# Altium schematic sheet Debug_SDIO.SchDoc: Debug SDIO
size A4
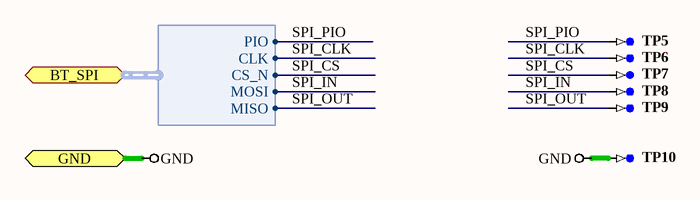
[diagram p0: Debug_SDIO.SchDoc]

## Parts
TP5  TP-SM-C-100  [TP-SM-C-100]  (value not drawn)  (no BOM)
TP6  TP-SM-C-100  [TP-SM-C-100]  (value not drawn)  (no BOM)
TP7  TP-SM-C-100  [TP-SM-C-100]  (value not drawn)  (no BOM)
TP8  TP-SM-C-100  [TP-SM-C-100]  (value not drawn)  (no BOM)
TP9  TP-SM-C-100  [TP-SM-C-100]  (value not drawn)  (no BOM)
TP10  TP-SM-C-100  [TP-SM-C-100]  (value not drawn)  (no BOM)

## Ports
BT_SPI (harness SPI_CSR1010), GND

## Harnesses
SPI_CSR1010: MISO, CS_N, PIO, MOSI, CLK

## Nets
GND: TP10.1 ; port GND
SPI_CLK: TP6.1 ; port BT_SPI.CLK
SPI_CS: TP7.1 ; port BT_SPI.CS_N
SPI_IN: TP8.1 ; port BT_SPI.MOSI
SPI_OUT: TP9.1 ; port BT_SPI.MISO
SPI_PIO: TP5.1 ; port BT_SPI.PIO

## Notes on the sheet
- Sheet Title
- Project Title
- Size:
- Date:
- A4
- Item:
- Time:
- Revision:
- Sheet
- of
- File:

## Library data of the parts
TP5-TP10 = CMP-0484-00002-1: Test Point, Surface Mount, Circular, Pad Diameter 1 mm